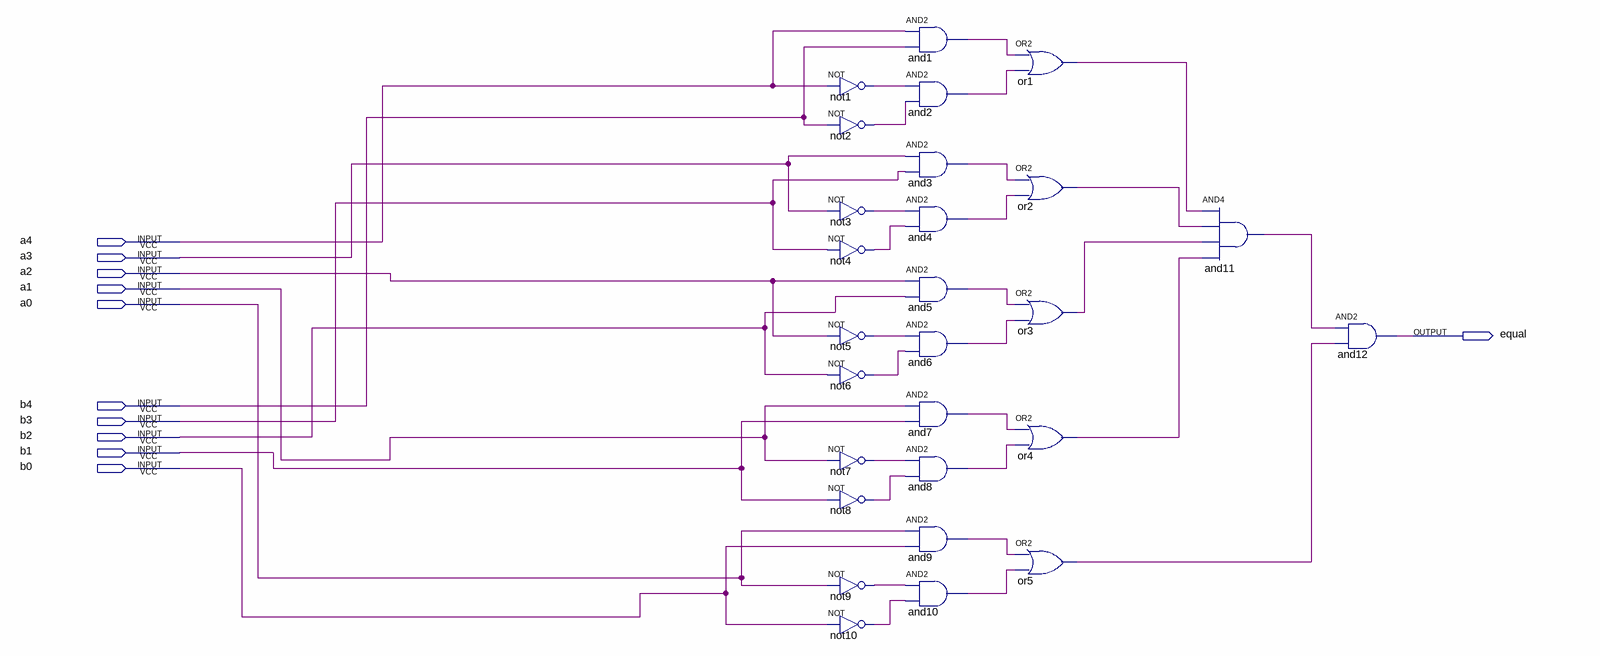
[diagram p0: schematic sheet]
// Quartus schematic 5bitcmp.bdf as structural Verilog: 27 symbols, 11 pins
module \5bitcmp  (
  input  a4,
  input  a3,
  input  a2,
  input  a1,
  input  a0,
  input  b4,
  input  b3,
  input  b2,
  input  b1,
  input  b0,
  output equal
);

  wire and1_out, and2_out, and3_out, and4_out, and5_out, and6_out, and7_out, and8_out, and9_out, and10_out,
       and11_out, not1_out, not2_out, not3_out, not4_out, not5_out, not6_out, not7_out, not8_out, not9_out,
       not10_out, or1_out, or2_out, or3_out, or4_out, or5_out;

  not not1 (not1_out, a4);
  not not2 (not2_out, b4);
  not not3 (not3_out, a3);
  not not4 (not4_out, b3);
  not not5 (not5_out, a2);
  not not6 (not6_out, b2);
  not not7 (not7_out, a1);
  not not8 (not8_out, b1);
  not not9 (not9_out, a0);
  not not10 (not10_out, b0);
  and and1 (and1_out, a4, b4);
  and and2 (and2_out, not1_out, not2_out);
  and and3 (and3_out, a3, b3);
  and and4 (and4_out, not3_out, not4_out);
  and and5 (and5_out, a2, b2);
  and and6 (and6_out, not5_out, not6_out);
  and and7 (and7_out, a1, b1);
  and and8 (and8_out, not7_out, not8_out);
  and and9 (and9_out, a0, b0);
  and and10 (and10_out, not9_out, not10_out);
  or or1 (or1_out, and1_out, and2_out);
  or or2 (or2_out, and3_out, and4_out);
  or or3 (or3_out, and5_out, and6_out);
  or or4 (or4_out, and7_out, and8_out);
  or or5 (or5_out, and9_out, and10_out);
  and and11 (and11_out, or1_out, or2_out, or3_out, or4_out);
  and and12 (equal, and11_out, or5_out);
endmodule
